# Altium project gpa-zynq-module.PrjPcb
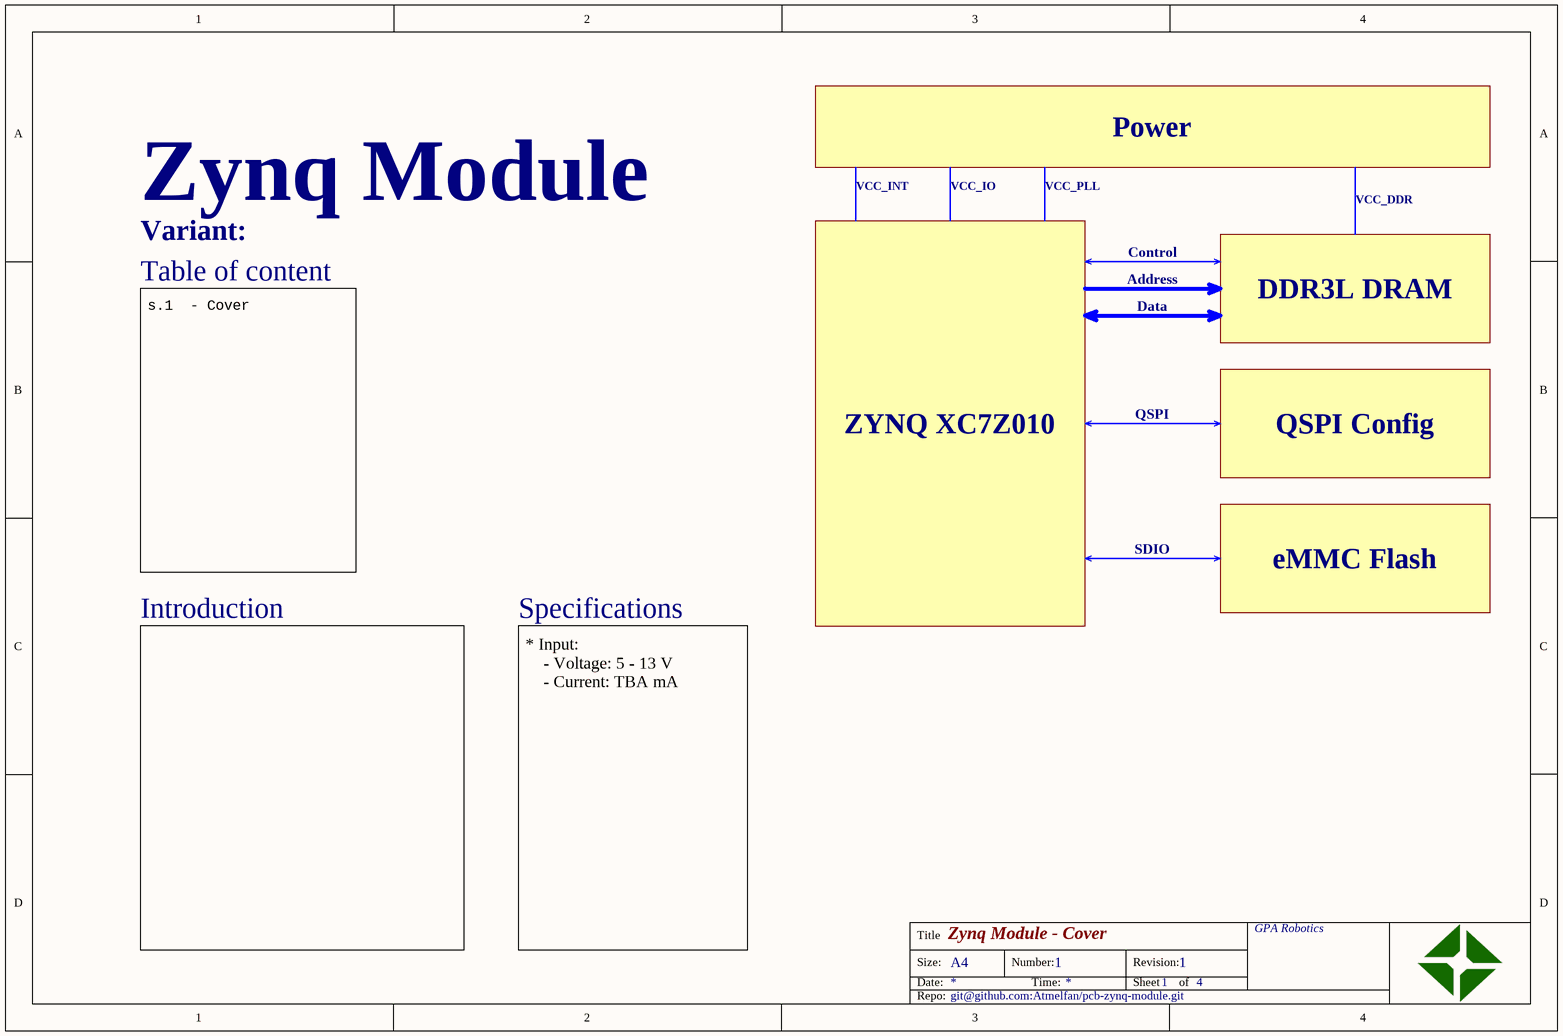
[diagram p0: cover.SchDoc]
project_author: Gustav Palmqvist; project_name: Zynq Module; project_repo: git@github.com:Atmelfan/pcb-zynq-module.git; project_revision: 1
11 sheets, 97 parts. Net scope: hierarchical (ports join the sheet entries above them; power ports are global).
Board file: model_a.PcbDoc
Sheets:
  cover.SchDoc
  connectors.SchDoc
    POWER = power.SchDoc
    ZYNQ = fpga.SchDoc
      FPGA_POWER = fpga_power.SchDoc
      FPGA_DDR3L = fpga_ddr3l.SchDoc
      FPGA_MISC = fpga_misc.SchDoc
      FPGA_MIO = fpga_mio.SchDoc
      FPGA_BANK34 = fpga_bank34.SchDoc
      FPGA_BANK35 = fpga_bank35.SchDoc
    ETHERNET = ethernet.SchDoc

## Sheet cover.SchDoc: Cover
size A4; Organization: GPA Robotics; DocumentNumber: 1; SheetNumber: 1; SheetTotal: 4

### Notes on the sheet
- Power
- VCC_INT
- VCC_IO
- VCC_PLL
- VCC_DDR
- Table of content
- Control
- Address
- Data
- DDR3L DRAM
- ZYNQ XC7Z010
- QSPI
- QSPI Config
- s.1  - Cover
- SDIO
- eMMC Flash
- Introduction
- Specifications
- * Input:
  - Voltage: 5 - 13 V
  - Current: TBA mA
- Variant:
- Title
- Size:
- Date:
- A4
- Number:
- Time:
- Revision:
- Sheet
- of
- Repo:

## Sheet connectors.SchDoc
size A4
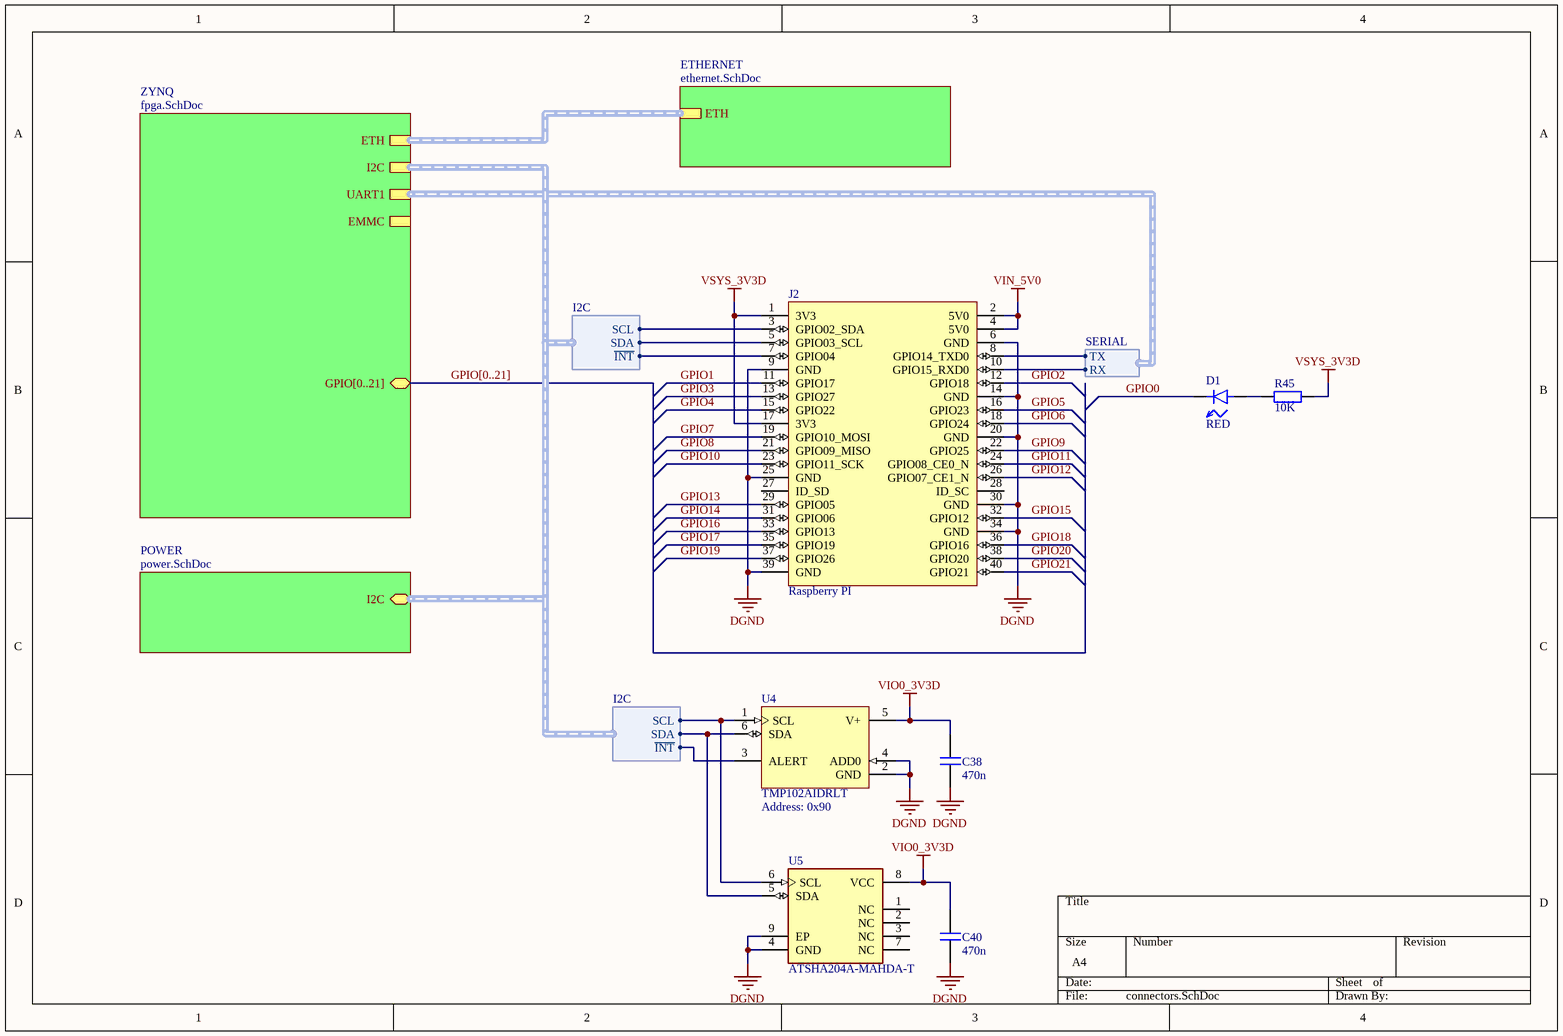
[diagram p1: connectors.SchDoc]

### Parts
C38  value 470n  [CAPC1608X08N]  (hidden comment: cap)
C40  value 470n  [CAPC1608X08N]  (hidden comment: cap)
D1  value RED  [CAPCP1005X06N]  (hidden comment: led)
J2  Raspberry PI  [raspi_male_con]
R45  value 10K  [RESC1005X04N]  (hidden comment: res)
U4  TMP102AIDRLT  Address: 0x90  [DRL0006A_L]
U5  ATSHA204A-MAHDA-T  [FP-C04-21355-Q4B-MFG]

### Sub-sheets
ETHERNET = ethernet.SchDoc: ETH (harness ETHERNET)
POWER = power.SchDoc: I2C (bidir, harness I2C)
ZYNQ = fpga.SchDoc: ETH (harness ETHERNET), I2C (harness I2C), EMMC (harness SDCARD), UART1 (harness SERIAL), GPIO[0..21] (bidir)

### Harnesses
I2C: SDA, SCL, ~{INT}
SERIAL: TX, RX

### Nets
DGND: C38.2 C40.2 J2.6(GND) J2.9(GND) J2.14(GND) J2.20(GND) J2.25(GND) J2.30(GND) J2.34(GND) J2.39(GND) U4.2(GND) U4.4(ADD0) U5.4(GND) U5.9(EP)
VIN_5V0: J2.2(5V0) J2.4(5V0)
VIO0_3V3D: C38.1 C40.1 U4.5(V+) U5.8(VCC)  [project net CFGBVS]
VSYS_3V3D: J2.1(3V3) J2.17(3V3) R45.2
~{I2C_INT}: J2.7(GPIO04) U4.3(ALERT) ; sheet POWER/I2C.~{INT}
GPIO0: D1.C
GPIO1: J2.11(GPIO17)
GPIO2: J2.12(GPIO18)
GPIO3: J2.13(GPIO27)
GPIO4: J2.15(GPIO22)
GPIO5: J2.16(GPIO23)
GPIO6: J2.18(GPIO24)
GPIO7: J2.19(GPIO10_MOSI)
GPIO8: J2.21(GPIO09_MISO)
GPIO9: J2.22(GPIO25)
GPIO10: J2.23(GPIO11_SCK)
GPIO11: J2.24(GPIO08_CE0_N)
GPIO12: J2.26(GPIO07_CE1_N)
GPIO13: J2.29(GPIO05)
GPIO14: J2.31(GPIO06)
GPIO15: J2.32(GPIO12)
GPIO16: J2.33(GPIO13)
GPIO17: J2.35(GPIO19)
GPIO18: J2.36(GPIO16)
GPIO19: J2.37(GPIO26)
GPIO20: J2.38(GPIO20)
GPIO21: J2.40(GPIO21)
I2C_SCL: J2.3(GPIO02_SDA) U4.1(SCL) U5.6(SCL) ; sheet POWER/I2C.SCL
I2C_SDA: J2.5(GPIO03_SCL) U4.6(SDA) U5.5(SDA) ; sheet POWER/I2C.SDA
UART1_RX: J2.10(GPIO15_RXD0) ; sheet ZYNQ/UART1.RX
UART1_TX: J2.8(GPIO14_TXD0) ; sheet ZYNQ/UART1.TX
NetD1_A: D1.A R45.1

Not connected (* = marked no-connect by the designer): J2 27(ID_SD) 28(ID_SC); U5 1(NC) 2(NC) 3(NC) 7(NC)

### Buses and harness runs
bus GPIO[0..21] = sheet ZYNQ/GPIO[0..21]
harness sheet ETHERNET/ETH = sheet ZYNQ/ETH
harness sheet POWER/I2C = sheet ZYNQ/I2C

### Library data of the parts
C38 C40 = cap: Capacitor; voltage: *; type: *; #digikey: *; #mouser: *
D1 = led: pin to pad: A>1 C>2
J2 = raspberry_2x20_con: Raspberry PI 2x20 connector
R45 = res: Resistor; power: *; voltage: *; #digikey: *; #mouser: *
U4 = CMP-1685-00013-1: Low Power Digital Temperature Sensor with SMBus and Two-Wire Serial Interface, 1.4 to 3.6 V, -40 to 125 degC, 6-Pin SOT (DRL), Green (RoHS & no Sb/Br), Tape and Reel; ComponentLink3URL: http://www.ti.com/lit/ml/mpds159c/mpds159c.pdf; PackageVersion: 4205622-3/D, 08/2207; ComponentLink2Description: Datasheet; PackageReference: DRL0006A; ComponentLink2URL: http://www.ti.com/lit/ds/symlink/tmp102.pdf; ComponentLink3Description: Package Specification; ComponentLink1Description: Manufacturer URL; DatasheetVersion: SBOS397F, 12/2015; PackageDescription: 6-Pin Plastic Small Outline, Body 1.6 x 1.2 mm, Pitch 0.5 mm; ComponentLink1URL: http://www.ti.com/
U5 = CMP-06260-000005-1: IC AUTHENTICATION CHIP 8UDFN; Manufacturer: Microchip Technology; Standoff Height: 0mm; Description: Peripheral Controller Atmel Crypto EEPROM 8-Pin UDFN; Ambient Temperature Range High: +85°C; Ambient Temperature Range Low: -40°C; Octopart: https://octopart.com/atsha204a-mahda-t-microchip-77761815; Device Class L1: Integrated Circuits (ICs); Digikey Description: IC AUTHENTICATION CHIP 8UDFN; RoHS: TRUE; Device Class L3: unset; Temperature: -40°C to +85°C; Temperature Range High: +85°C; Height: 0.6mm; Device Class L2: unset; Category: IC; Automotive: No; Package: C04-21355-Q4B; Lead Free: Yes; ComponentLink2Description: Datasheet; Temperature Range Low: -40°C; ComponentLink2URL: http://ww1.microchip.com/downloads/en/DeviceDoc/ATSHA204A-Data-Sheet-40002025A.pdf; Manufacturer Part Number: ATSHA204A-MAHDA-T

## Sheet power.SchDoc: Power supplies
size A4; Organization: GPA Robotics; DocumentNumber: 2; Revision: REV 0; SheetNumber: 2; SheetTotal: 4
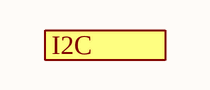
[diagram p2: power.SchDoc]

### Ports
I2C (harness I2C)

### Notes on the sheet
- Title
- Size:
- Date:
- A4
- Number:
- Time:
- Revision:
- Sheet
- of
- Repo:

## Sheet fpga.SchDoc
size A4
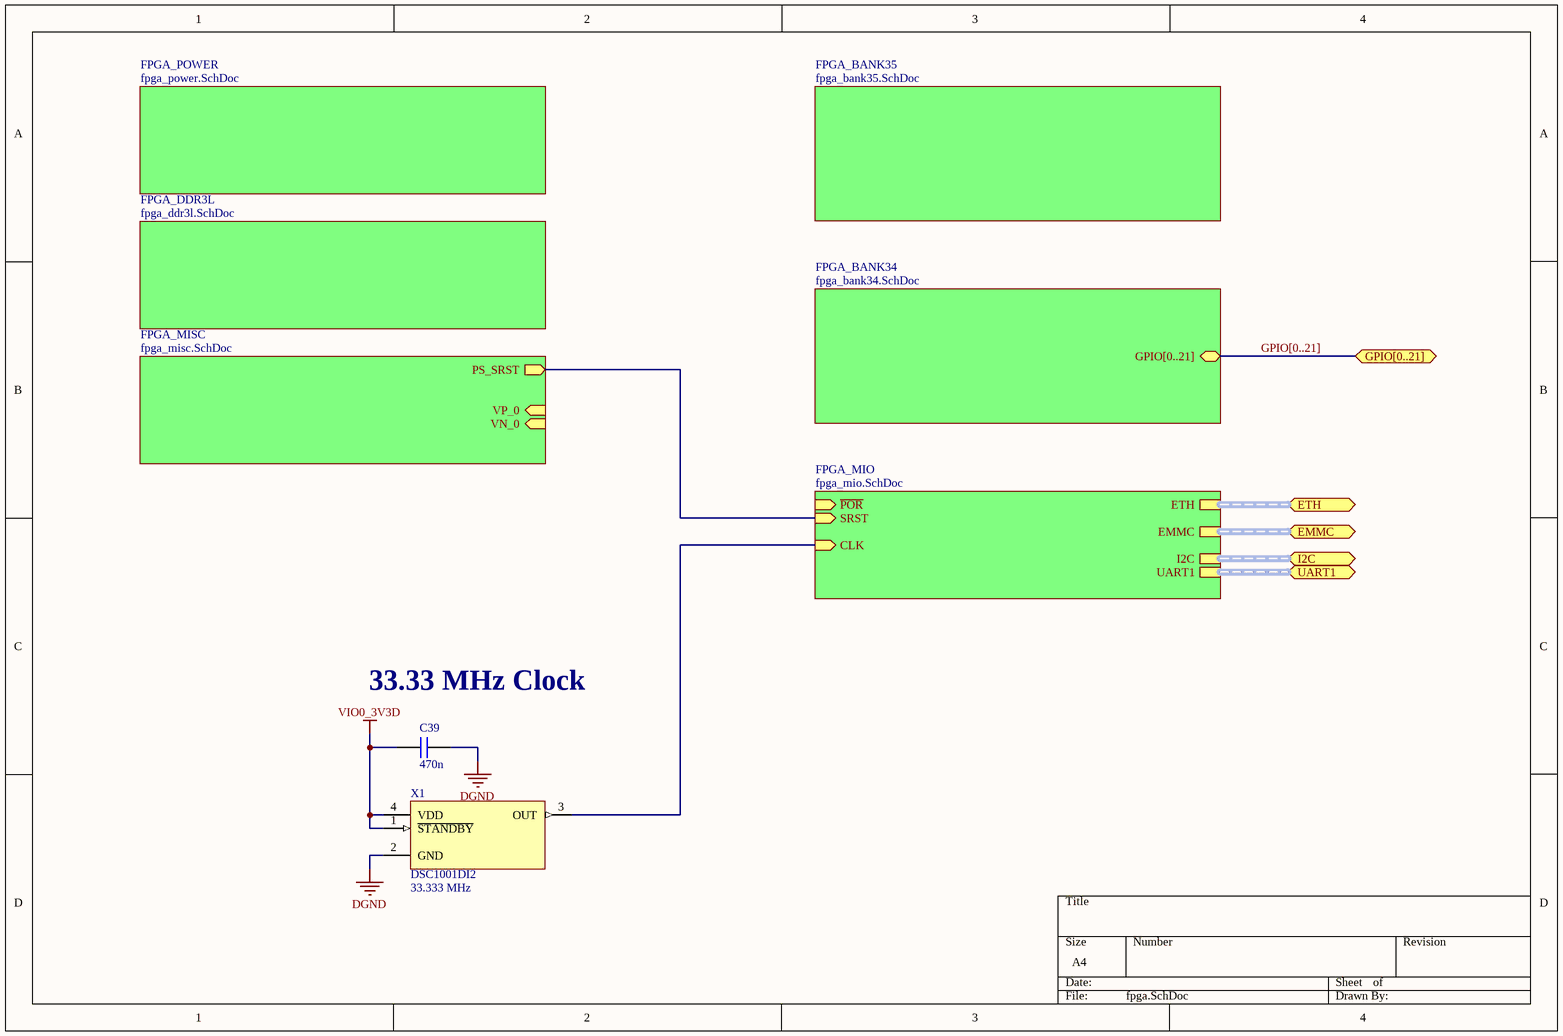
[diagram p3: fpga.SchDoc]

### Parts
C39  value 470n  [CAPC1608X08N]  (hidden comment: cap)
X1  DSC1001DI2  Frequency: 33.333 MHz  [DFN165P200X90-4N_DSC1001DIx]

### Sub-sheets
FPGA_BANK34 = fpga_bank34.SchDoc: GPIO[0..21] (bidir)
FPGA_BANK35 = fpga_bank35.SchDoc: no entries
FPGA_DDR3L = fpga_ddr3l.SchDoc: no entries
FPGA_MIO = fpga_mio.SchDoc: UART1 (harness SERIAL), ~{POR} (in), CLK (in), EMMC (harness SDCARD), I2C (harness I2C), SRST (in), ETH (harness ETHERNET)
FPGA_MISC = fpga_misc.SchDoc: VP_0 (in), VN_0 (in), PS_SRST (out)
FPGA_POWER = fpga_power.SchDoc: no entries

### Ports
EMMC (bidir), ETH (bidir), GPIO[0..21] (bidir), I2C (bidir), UART1 (bidir)

### Nets
DGND: C39.1 X1.2(GND)
VIO0_3V3D: C39.2 X1.1(~{STANDBY}) X1.4(VDD)  [project net CFGBVS]
NetJ1_10: sheet FPGA_MISC/PS_SRST, sheet FPGA_MIO/SRST
NetU2_C7: X1.3(OUT) ; sheet FPGA_MIO/CLK

### Buses and harness runs
bus GPIO[0..21] = port GPIO[0..21] = sheet FPGA_BANK34/GPIO[0..21]
harness port EMMC = sheet FPGA_MIO/EMMC
harness port ETH = sheet FPGA_MIO/ETH
harness port I2C = sheet FPGA_MIO/I2C
harness port UART1 = sheet FPGA_MIO/UART1

### Notes on the sheet
- (near C39) 33.33 MHz Clock

### Library data of the parts
C39 = cap: Capacitor; voltage: *; type: *; #digikey: *; #mouser: *
X1 = dsc1001dix: 1.8V-3.3V Low-Power Precision CMOS Oscillators

## Sheet fpga_power.SchDoc: FPGA Power
size A4; Organization: GPA Robotics; Revision: REV 0
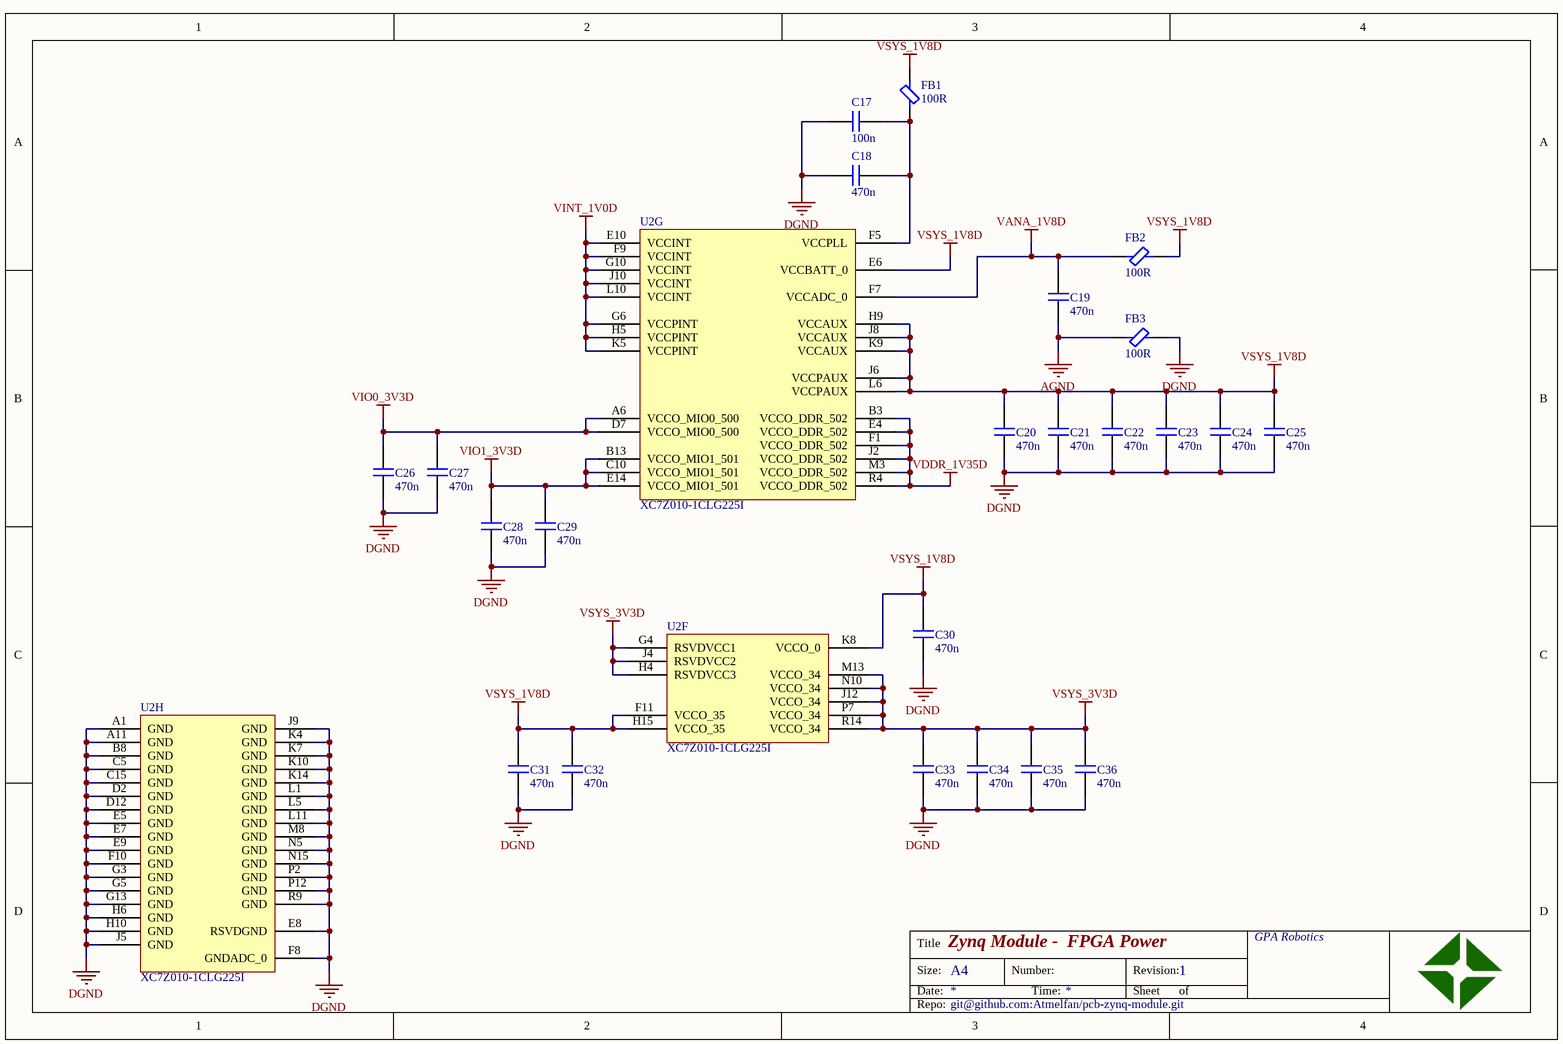
[diagram p4: fpga_power.SchDoc]

### Parts
C17  value 100n  [CAPC2012X11N]  (hidden comment: cap)
C18  value 470n  [CAPC1608X08N]  (hidden comment: cap)
C19  value 470n  [CAPC1608X08N]  (hidden comment: cap)
C20  value 470n  [CAPC1608X08N]  (hidden comment: cap)
C21  value 470n  [CAPC1608X08N]  (hidden comment: cap)
C22  value 470n  [CAPC1608X08N]  (hidden comment: cap)
C23  value 470n  [CAPC1608X08N]  (hidden comment: cap)
C24  value 470n  [CAPC1608X08N]  (hidden comment: cap)
C25  value 470n  [CAPC1608X08N]  (hidden comment: cap)
C26  value 470n  [CAPC1608X08N]  (hidden comment: cap)
C27  value 470n  [CAPC1608X08N]  (hidden comment: cap)
C28  value 470n  [CAPC1608X08N]  (hidden comment: cap)
C29  value 470n  [CAPC1608X08N]  (hidden comment: cap)
C30  value 470n  [CAPC1608X08N]  (hidden comment: cap)
C31  value 470n  [CAPC1608X08N]  (hidden comment: cap)
C32  value 470n  [CAPC1608X08N]  (hidden comment: cap)
C33  value 470n  [CAPC1608X08N]  (hidden comment: cap)
C34  value 470n  [CAPC1608X08N]  (hidden comment: cap)
C35  value 470n  [CAPC1608X08N]  (hidden comment: cap)
C36  value 470n  [CAPC1608X08N]  (hidden comment: cap)
FB1  value 100R  [INDC1005X06N]  (hidden comment: ferrite)
FB2  value 100R  [INDC1005X06N]  (hidden comment: ferrite)
FB3  value 100R  [INDC1005X06N]  (hidden comment: ferrite)
U2  XC7Z010-1CLG225I  [CLG225]  (parts F,G,H of 8)

### Nets
AGND: C19.1 FB3.2
DGND: C17.1 C18.1 C20.1 C21.1 C22.1 C23.1 C24.1 C25.1 C26.1 C27.1 C28.1 C29.1 C30.1 C31.1 C32.1 C33.1 C34.1 C35.1 C36.1 FB3.1 U2.A1(GND) U2.A11(GND) U2.B8(GND) U2.C5(GND) U2.C15(GND) U2.D2(GND) U2.D12(GND) U2.E5(GND) U2.E7(GND) U2.E8(RSVDGND) U2.E9(GND) U2.F8(GNDADC_0) U2.F10(GND) U2.G3(GND) U2.G5(GND) U2.G13(GND) U2.H6(GND) U2.H10(GND) U2.J5(GND) U2.J9(GND) U2.K4(GND) U2.K7(GND) U2.K10(GND) U2.K14(GND) U2.L1(GND) U2.L5(GND) U2.L11(GND) U2.M8(GND) U2.N5(GND) U2.N15(GND) U2.P2(GND) U2.P12(GND) U2.R9(GND)
VANA_1V8D: C19.2 FB2.2 U2.F7(VCCADC_0)
VDDR_1V35D: U2.B3(VCCO_DDR_502) U2.E4(VCCO_DDR_502) U2.F1(VCCO_DDR_502) U2.J2(VCCO_DDR_502) U2.M3(VCCO_DDR_502) U2.R4(VCCO_DDR_502)
VINT_1V0D: U2.E10(VCCINT) U2.F9(VCCINT) U2.G6(VCCPINT) U2.G10(VCCINT) U2.H5(VCCPINT) U2.J10(VCCINT) U2.K5(VCCPINT) U2.L10(VCCINT)
VIO0_3V3D: C26.2 C27.2 U2.A6(VCCO_MIO0_500) U2.D7(VCCO_MIO0_500)  [project net CFGBVS]
VIO1_3V3D: C28.2 C29.2 U2.B13(VCCO_MIO1_501) U2.C10(VCCO_MIO1_501) U2.E14(VCCO_MIO1_501)
VSYS_1V8D: C20.2 C21.2 C22.2 C23.2 C24.2 C25.2 C30.2 C31.2 C32.2 FB1.2 FB2.1 U2.E6(VCCBATT_0) U2.F11(VCCO_35) U2.H9(VCCAUX) U2.H15(VCCO_35) U2.J6(VCCPAUX) U2.J8(VCCAUX) U2.K8(VCCO_0) U2.K9(VCCAUX) U2.L6(VCCPAUX)
VSYS_3V3D: C33.2 C34.2 C35.2 C36.2 U2.G4(RSVDVCC1) U2.H4(RSVDVCC3) U2.J4(RSVDVCC2) U2.J12(VCCO_34) U2.M13(VCCO_34) U2.N10(VCCO_34) U2.P7(VCCO_34) U2.R14(VCCO_34)
NetC17_2: C17.2 C18.2 FB1.1 U2.F5(VCCPLL)

### Notes on the sheet
- Title
- Size:
- Date:
- A4
- Number:
- Time:
- Revision:
- Sheet
- of
- Repo:

### Library data of the parts
C17-C36 = cap: Capacitor; voltage: *; type: *; #digikey: *; #mouser: *
FB1-FB3 = ferrite: Inductor; #digikey: *; #mouser: *
U2 = CMP-0382-00001-1: 667 MHz Zynq™-7000 AP SoC, 88 PS I/O, 54 FPGA I/O, 225-Ball BGA, Speed Grade 1, Industrial Grade, Pb-Free; LUTs: 17600; Extensible Block RAM (# 36Kb Blocks): 240 KB (60); Speed Grade: -1; Flip Flops: 35200; DatasheetVersion: v1.2; ComponentLink4Description: Package File; ComponentLink1URL: http://www.xilinx.com/support/documentation/data_sheets/ds190-Zynq-7000-Overview.pdf; ComponentLink5URL: http://www.xilinx.com/support/documentation/user_guides/ug865-Zynq-7000-Pkg-Pinout.pdf; ComponentLink5Description: Packaging and Pinout; PartNumber: XC7Z010-1CLG225I; PackageVersion: Rev 1.2, 02/2013; ComponentLink3Description: DC and AC Switching Characteristics; ComponentLink2URL: http://www.xilinx.com/support/documentation/user_guides/ug865-Zynq-7000-Pkg-Pinout.pdf; ComponentLink3URL: http://www.xilinx.com/support/documentation/data_sheets/ds187-XC7Z010-XC7Z020-Data-Sheet.pdf; ComponentLink6URL: http://www.xilinx.com/support/documentation/user_guides/ug483_7Series_PCB.pdf; ComponentLink2Description: Package Specification; PackageReference: CLG225; ComponentLink1Description: Datasheet; ComponentLink4URL: http://www.xilinx.com/support/packagefiles/z7packages/xc7z010clg225pkg.txt; Generic Part Number: XC7Z010; ComponentLink6Description: PCB and Layout Guide; Mounting Technology: Surface Mount; PackageDescription: Wire-Bond Chip-Scale BGA, Body 13 x 13 mm, 0.8 mm Pitch; Code_JEDEC: MO-275-HHAC-1; RoHS: Pb-Free

## Sheet fpga_ddr3l.SchDoc: FPGA DDR3L Memory
size A4; Organization: GPA Robotics; DocumentNumber: 4; Revision: REV 0; SheetNumber: 4; SheetTotal: 4
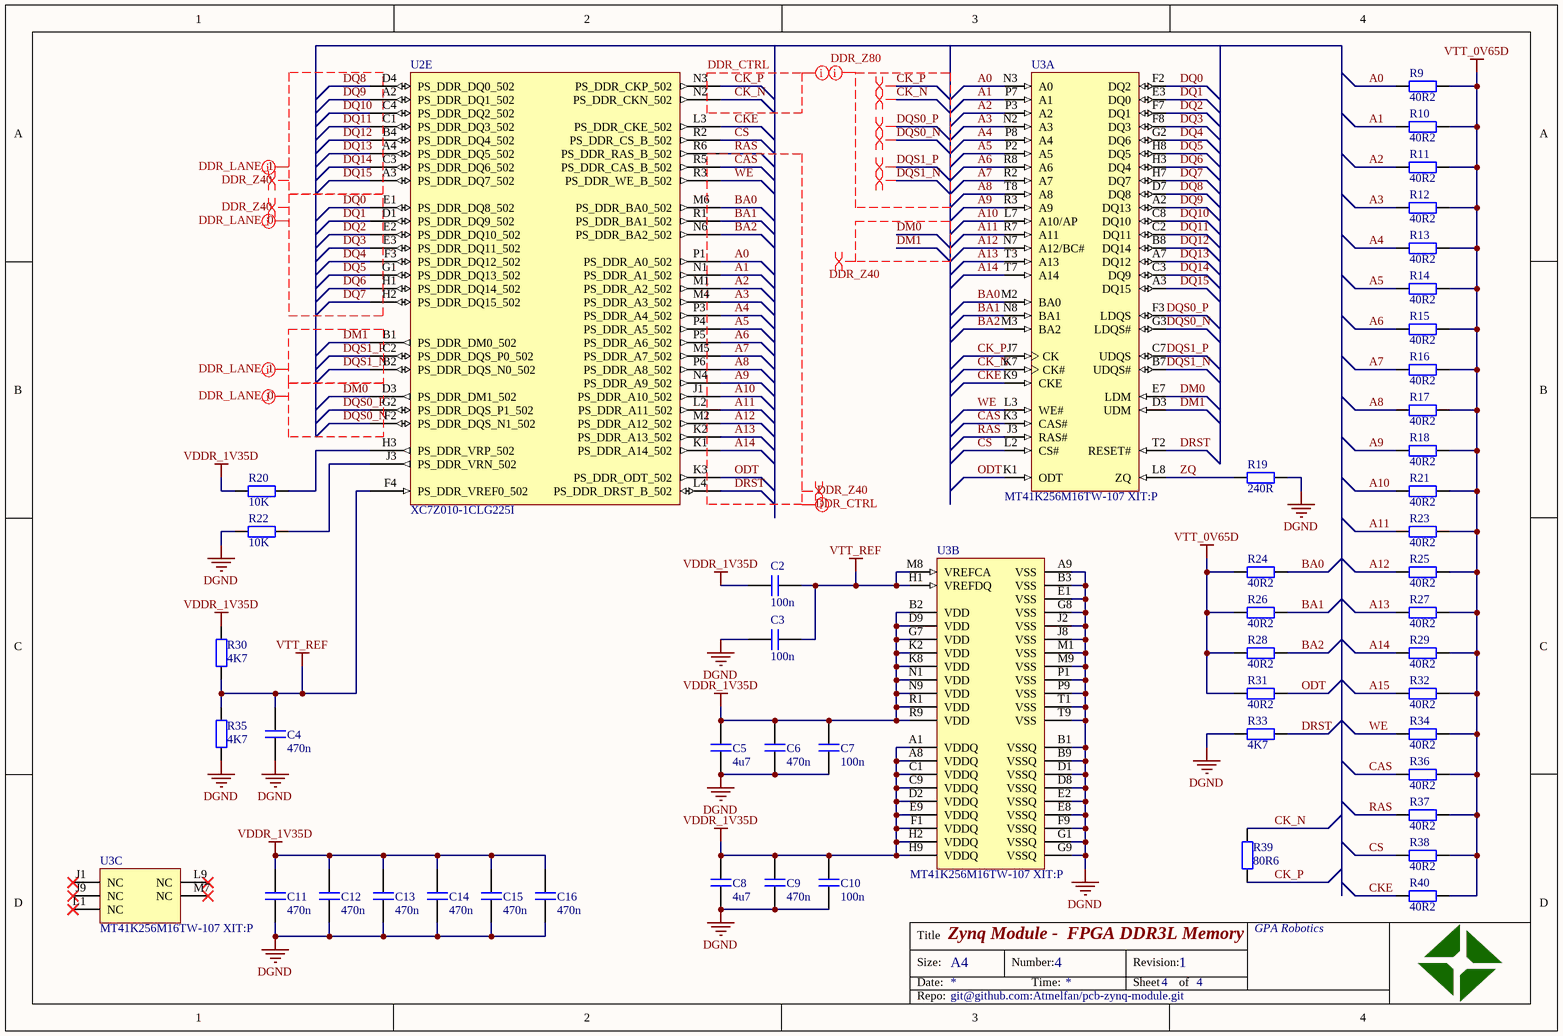
[diagram p5: fpga_ddr3l.SchDoc]

### Parts
C2  value 100n  [CAPC1005X06N]  (hidden comment: cap)
C3  value 100n  [CAPC1005X06N]  (hidden comment: cap)
C4  value 470n  [CAPC1005X06N]  (hidden comment: cap)
C5  value 4u7  [CAPC1608X08N]  (hidden comment: cap)
C6  value 470n  [CAPC1005X06N]  (hidden comment: cap)
C7  value 100n  [CAPC1005X06N]  (hidden comment: cap)
C8  value 4u7  [CAPC1608X08N]  (hidden comment: cap)
C9  value 470n  [CAPC1005X06N]  (hidden comment: cap)
C10  value 100n  [CAPC1005X06N]  (hidden comment: cap)
C11  value 470n  [CAPC1005X06N]  (hidden comment: cap)
C12  value 470n  [CAPC1005X06N]  (hidden comment: cap)
C13  value 470n  [CAPC1005X06N]  (hidden comment: cap)
C14  value 470n  [CAPC1005X06N]  (hidden comment: cap)
C15  value 470n  [CAPC1005X06N]  (hidden comment: cap)
C16  value 470n  [CAPC1005X06N]  (hidden comment: cap)
R9  value 40R2  [RESC1005X04N]  (hidden comment: res)
R10  value 40R2  [RESC1005X04N]  (hidden comment: res)
R11  value 40R2  [RESC1005X04N]  (hidden comment: res)
R12  value 40R2  [RESC1005X04N]  (hidden comment: res)
R13  value 40R2  [RESC1005X04N]  (hidden comment: res)
R14  value 40R2  [RESC1005X04N]  (hidden comment: res)
R15  value 40R2  [RESC1005X04N]  (hidden comment: res)
R16  value 40R2  [RESC1005X04N]  (hidden comment: res)
R17  value 40R2  [RESC1005X04N]  (hidden comment: res)
R18  value 40R2  [RESC1005X04N]  (hidden comment: res)
R19  value 240R  [RESC1005X04N]  (hidden comment: res)
R20  value 10K  [RESC1005X04N]  (hidden comment: res)
R21  value 40R2  [RESC1005X04N]  (hidden comment: res)
R22  value 10K  [RESC1005X04N]  (hidden comment: res)
R23  value 40R2  [RESC1005X04N]  (hidden comment: res)
R24  value 40R2  [RESC1005X04N]  (hidden comment: res)
R25  value 40R2  [RESC1005X04N]  (hidden comment: res)
R26  value 40R2  [RESC1005X04N]  (hidden comment: res)
R27  value 40R2  [RESC1005X04N]  (hidden comment: res)
R28  value 40R2  [RESC1005X04N]  (hidden comment: res)
R29  value 40R2  [RESC1005X04N]  (hidden comment: res)
R30  value 4K7  [RESC1005X04N]  (hidden comment: res)
R31  value 40R2  [RESC1005X04N]  (hidden comment: res)
R32  value 40R2  [RESC1005X04N]  (hidden comment: res)
R33  value 4K7  [RESC1005X04N]  (hidden comment: res)
R34  value 40R2  [RESC1005X04N]  (hidden comment: res)
R35  value 4K7  [RESC1005X04N]  (hidden comment: res)
R36  value 40R2  [RESC1005X04N]  (hidden comment: res)
R37  value 40R2  [RESC1005X04N]  (hidden comment: res)
R38  value 40R2  [RESC1005X04N]  (hidden comment: res)
R39  value 80R6  [RESC1005X04N]  (hidden comment: res)
R40  value 40R2  [RESC1005X04N]  (hidden comment: res)
U2  XC7Z010-1CLG225I  [CLG225]  (part E of 8)
U3  MT41K256M16TW-107 XIT:P  [MICT-TW-96]  (parts A,B,C of 3)

### Nets
DGND: C3.1 C4.1 C5.1 C6.1 C7.1 C8.1 C9.1 C10.1 C11.1 C12.1 C13.1 C14.1 C15.1 C16.1 R19.2 R22.1 R33.2 R35.1 U3.A9(VSS) U3.B1(VSSQ) U3.B3(VSS) U3.B9(VSSQ) U3.D1(VSSQ) U3.D8(VSSQ) U3.E1(VSS) U3.E2(VSSQ) U3.E8(VSSQ) U3.F9(VSSQ) U3.G1(VSSQ) U3.G8(VSS) U3.G9(VSSQ) U3.J2(VSS) U3.J8(VSS) U3.M1(VSS) U3.M9(VSS) U3.P1(VSS) U3.P9(VSS) U3.T1(VSS) U3.T9(VSS)
VDDR_1V35D: C2.1 C5.2 C6.2 C7.2 C8.2 C9.2 C10.2 C11.2 C12.2 C13.2 C14.2 C15.2 C16.2 R20.1 R30.2 U3.A1(VDDQ) U3.A8(VDDQ) U3.B2(VDD) U3.C1(VDDQ) U3.C9(VDDQ) U3.D2(VDDQ) U3.D9(VDD) U3.E9(VDDQ) U3.F1(VDDQ) U3.G7(VDD) U3.H2(VDDQ) U3.H9(VDDQ) U3.K2(VDD) U3.K8(VDD) U3.N1(VDD) U3.N9(VDD) U3.R1(VDD) U3.R9(VDD)
VTT_0V65D: R9.2 R10.2 R11.2 R12.2 R13.2 R14.2 R15.2 R16.2 R17.2 R18.2 R21.2 R23.2 R24.2 R25.2 R26.2 R27.2 R28.2 R29.2 R31.2 R32.2 R34.2 R36.2 R37.2 R38.2 R40.2
VTT_REF: C2.2 C3.2 C4.2 R30.1 R35.2 U2.F4(PS_DDR_VREF0_502) U3.H1(VREFDQ) U3.M8(VREFCA)
A0: R9.1 U2.P1(PS_DDR_A0_502) U3.N3(A0)
A1: R10.1 U2.N1(PS_DDR_A1_502) U3.P7(A1)
A2: R11.1 U2.M1(PS_DDR_A2_502) U3.P3(A2)
A3: R12.1 U2.M4(PS_DDR_A3_502) U3.N2(A3)
A4: R13.1 U2.P3(PS_DDR_A4_502) U3.P8(A4)
A5: R14.1 U2.P4(PS_DDR_A5_502) U3.P2(A5)
A6: R15.1 U2.P5(PS_DDR_A6_502) U3.R8(A6)
A7: R16.1 U2.M5(PS_DDR_A7_502) U3.R2(A7)
A8: R17.1 U2.P6(PS_DDR_A8_502) U3.T8(A8)
A9: R18.1 U2.N4(PS_DDR_A9_502) U3.R3(A9)
A10: R21.1 U2.J1(PS_DDR_A10_502) U3.L7(A10/AP)
A11: R23.1 U2.L2(PS_DDR_A11_502) U3.R7(A11)
A12: R25.1 U2.M2(PS_DDR_A12_502) U3.N7(A12/BC#)
A13: R27.1 U2.K2(PS_DDR_A13_502) U3.T3(A13)
A14: R29.1 U2.K1(PS_DDR_A14_502) U3.T7(A14)
A15: R32.1
BA0: R24.1 U2.M6(PS_DDR_BA0_502) U3.M2(BA0)
BA1: R26.1 U2.R1(PS_DDR_BA1_502) U3.N8(BA1)
BA2: R28.1 U2.N6(PS_DDR_BA2_502) U3.M3(BA2)
CAS: R36.1 U2.R5(PS_DDR_CAS_B_502) U3.K3(CAS#)
CK_N: R39.1 U2.N2(PS_DDR_CKN_502) U3.K7(CK#)
CK_P: R39.2 U2.N3(PS_DDR_CKP_502) U3.J7(CK)
CKE: R40.1 U2.L3(PS_DDR_CKE_502) U3.K9(CKE)
CS: R38.1 U2.R2(PS_DDR_CS_B_502) U3.L2(CS#)
DM0: U2.D3(PS_DDR_DM1_502) U3.E7(LDM)
DM1: U2.B1(PS_DDR_DM0_502) U3.D3(UDM)
DQ0: U2.E1(PS_DDR_DQ8_502) U3.F2(DQ2)
DQ1: U2.D1(PS_DDR_DQ9_502) U3.E3(DQ0)
DQ2: U2.E2(PS_DDR_DQ10_502) U3.F7(DQ1)
DQ3: U2.E3(PS_DDR_DQ11_502) U3.F8(DQ3)
DQ4: U2.F3(PS_DDR_DQ12_502) U3.G2(DQ6)
DQ5: U2.G1(PS_DDR_DQ13_502) U3.H8(DQ5)
DQ6: U2.H1(PS_DDR_DQ14_502) U3.H3(DQ4)
DQ7: U2.H2(PS_DDR_DQ15_502) U3.H7(DQ7)
DQ8: U2.D4(PS_DDR_DQ0_502) U3.D7(DQ8)
DQ9: U2.A2(PS_DDR_DQ1_502) U3.A2(DQ13)
DQ10: U2.C4(PS_DDR_DQ2_502) U3.C8(DQ10)
DQ11: U2.C1(PS_DDR_DQ3_502) U3.C2(DQ11)
DQ12: U2.B4(PS_DDR_DQ4_502) U3.B8(DQ14)
DQ13: U2.A4(PS_DDR_DQ5_502) U3.A7(DQ12)
DQ14: U2.C3(PS_DDR_DQ6_502) U3.C3(DQ9)
DQ15: U2.A3(PS_DDR_DQ7_502) U3.A3(DQ15)
DQS0_N: U2.F2(PS_DDR_DQS_N1_502) U3.G3(LDQS#)
DQS0_P: U2.G2(PS_DDR_DQS_P1_502) U3.F3(LDQS)
DQS1_N: U2.B2(PS_DDR_DQS_N0_502) U3.B7(UDQS#)
DQS1_P: U2.C2(PS_DDR_DQS_P0_502) U3.C7(UDQS)
DRST: R33.1 U2.L4(PS_DDR_DRST_B_502) U3.T2(RESET#)
ODT: R31.1 U2.K3(PS_DDR_ODT_502) U3.K1(ODT)
RAS: R37.1 U2.R6(PS_DDR_RAS_B_502) U3.J3(RAS#)
WE: R34.1 U2.R3(PS_DDR_WE_B_502) U3.L3(WE#)
ZQ: R19.1 U3.L8(ZQ)
NetR20_2: R20.2 U2.H3(PS_DDR_VRP_502)
NetR22_2: R22.2 U2.J3(PS_DDR_VRN_502)

Not connected (* = marked no-connect by the designer): U3 J1(NC)* J9(NC)* L1(NC)* L9(NC)* M7(NC)*

### Layout directives
net class DDR_CTRL: A0, A1, A2, A3, A4, A5, A6, A7, A8, A9, A10, A11, A12, A13, A14, BA0, BA1, BA2, CAS, CK_N, CK_P, DRST, ODT, RAS, WE
net class DDR_LANE_1; rule Matched Net Lengths [Delay Tolerance = 15ps]: DM1, DQ8, DQ9, DQ10, DQ11, DQ12, DQ13, DQ14, DQ15, DQS1_N, DQS1_P
net class DDR_LANE_0; rule Matched Net Lengths [Delay Tolerance = 15ps]: DM0, DQ0, DQ1, DQ2, DQ3, DQ4, DQ5, DQ6, DQ7, DQS0_N, DQS0_P
net class DDR_Z40: A0, A1, A2, A3, A4, A5, A6, A7, A8, A9, A10, A11, A12, A13, A14, BA0, BA1, BA2, CAS, DM0, DM1, DQ0, DQ1, DQ2, DQ3, DQ4, DQ5, DQ6, DQ7, DQ8, DQ9, DQ10, DQ11, DQ12, DQ13, DQ14, DQ15, DRST, ODT, RAS, WE
differential pair: CK_N, CK_P, DQS0_N, DQS0_P, DQS1_N, DQS1_P
net class DDR_Z80; rule Matched Net Lengths [Tolerance = 5mil]: CK_N, CK_P, DQS0_N, DQS0_P, DQS1_N, DQS1_P

### Notes on the sheet
- Title
- Size:
- Date:
- A4
- Number:
- Time:
- Revision:
- Sheet
- of
- Repo:

### Library data of the parts
C2-C16 = cap: Capacitor; voltage: *; type: *; #digikey: *; #mouser: *
R9-R40 = res: Resistor; power: *; voltage: *; #digikey: *; #mouser: *
U2 = CMP-0382-00001-1: as U2 on sheet fpga_power; DatasheetVersion: v1.2; ComponentLink4Description: Package File; ComponentLink1URL: http://www.xilinx.com/support/documentation/data_sheets/ds190-Zynq-7000-Overview.pdf; ComponentLink5URL: http://www.xilinx.com/support/documentation/user_guides/ug865-Zynq-7000-Pkg-Pinout.pdf; ComponentLink5Description: Packaging and Pinout; PartNumber: XC7Z010-1CLG225I; PackageVersion: Rev 1.2, 02/2013; ComponentLink3Description: DC and AC Switching Characteristics; ComponentLink2URL: http://www.xilinx.com/support/documentation/user_guides/ug865-Zynq-7000-Pkg-Pinout.pdf; ComponentLink3URL: http://www.xilinx.com/support/documentation/data_sheets/ds187-XC7Z010-XC7Z020-Data-Sheet.pdf; ComponentLink6URL: http://www.xilinx.com/support/documentation/user_guides/ug483_7Series_PCB.pdf; ComponentLink2Description: Package Specification; PackageReference: CLG225; ComponentLink1Description: Datasheet; ComponentLink4URL: http://www.xilinx.com/support/packagefiles/z7packages/xc7z010clg225pkg.txt; Generic Part Number: XC7Z010; ComponentLink6Description: PCB and Layout Guide; Mounting Technology: Surface Mount; PackageDescription: Wire-Bond Chip-Scale BGA, Body 13 x 13 mm, 0.8 mm Pitch; Code_JEDEC: MO-275-HHAC-1; RoHS: Pb-Free
U3 = CMP-2000-07474-1: DDR3L SDRAM, 4 GB, 933 MHz, 1.283 to 1.45 V, -40 to 95 degC, 96-Pin FBGA, RoHs, Tray; Manufacturer: Micron; Density: 4Gb; Interface: Parallel; Access Time: 1.07ns; Data Bus Width: 16b; Case\/Package: TFBGA; Address Bus Width: 15b; Frequency: 933MHz; Memory Type: RAM; Contact Plating: Silver; RoHSCompliant: true; Datasheet URL: https://www.micron.com/~/media/documents/products/data-sheet/dram/ddr3/4gb_1_35v_ddr3l_xit_addendum.pdf; Manufacturer URL: http://www.micron.com/; Mount: SurfaceMount; Max Operating Temperature: 95degC; Datasheet Version: Rev. A, 02/2016; Min Operating Temperature: -40degC; Packaging: Tray; Mounting Technology: SurfaceMount; Max Frequency: 933MHz; Package Reference: TW-96; Package Description: 96-Ball Fine Pitch Ball Grid Array, Body 14 x 8 mm, Pitch 0.8 mm

## Sheet fpga_misc.SchDoc
size A4
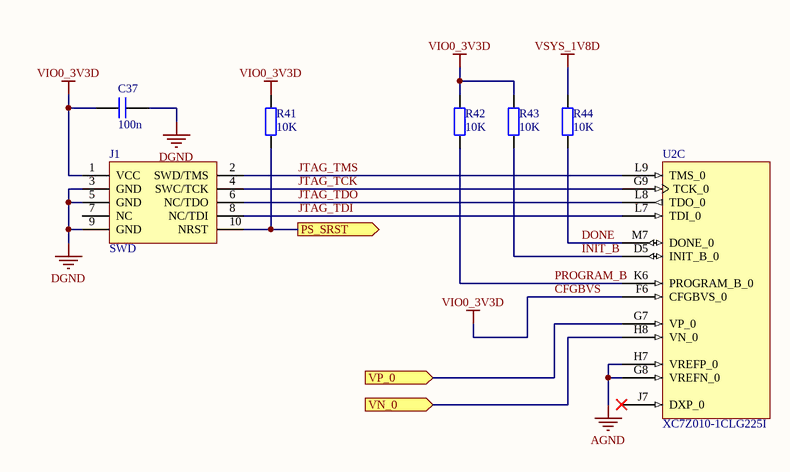
[diagram p6: fpga_misc.SchDoc]

### Parts
C37  value 100n  [CAPC1005X06N]  (hidden comment: cap)
J1  SWD  [hdr_2x5_50mil]
R41  value 10K  [RESC1005X04N]  (hidden comment: res)
R42  value 10K  [RESC1005X04N]  (hidden comment: res)
R43  value 10K  [RESC1005X04N]  (hidden comment: res)
R44  value 10K  [RESC1005X04N]  (hidden comment: res)
U2  XC7Z010-1CLG225I  [CLG225]  (part C of 8)

### Ports
PS_SRST (out), VN_0 (in), VP_0 (in)

### Nets
AGND: U2.G8(VREFN_0) U2.H7(VREFP_0)
CFGBVS: C37.1 J1.1(VCC) R41.2 R42.2 R43.2 U2.F6(CFGBVS_0)  [also labelled VIO0_3V3D]
DGND: C37.2 J1.3(GND) J1.5(GND) J1.9(GND)
VSYS_1V8D: R44.2
DONE: R44.1 U2.M7(DONE_0)
INIT_B: R43.1 U2.D5(INIT_B_0)
JTAG_TCK: J1.4(SWC/TCK) U2.G9(TCK_0)
JTAG_TDI: J1.8(NC/TDI) U2.L7(TDI_0)
JTAG_TDO: J1.6(NC/TDO) U2.L8(TDO_0)
JTAG_TMS: J1.2(SWD/TMS) U2.L9(TMS_0)
PROGRAM_B: R42.1 U2.K6(PROGRAM_B_0)
NetJ1_10: J1.10(NRST) R41.1 ; port PS_SRST
NetU2_G7: U2.G7(VP_0) ; port VP_0
NetU2_H8: U2.H8(VN_0) ; port VN_0

Not connected (* = marked no-connect by the designer): J1 7(NC); U2 J7(DXP_0)*

### Library data of the parts
C37 = cap: Capacitor; voltage: *; type: *; #digikey: *; #mouser: *
J1 = hdr_swd: SWD Header
R41-R44 = res: Resistor; power: *; voltage: *; #digikey: *; #mouser: *
U2 = CMP-0382-00001-1: as U2 on sheet fpga_power; DatasheetVersion: v1.2; ComponentLink4Description: Package File; ComponentLink1URL: http://www.xilinx.com/support/documentation/data_sheets/ds190-Zynq-7000-Overview.pdf; ComponentLink5URL: http://www.xilinx.com/support/documentation/user_guides/ug865-Zynq-7000-Pkg-Pinout.pdf; ComponentLink5Description: Packaging and Pinout; PartNumber: XC7Z010-1CLG225I; PackageVersion: Rev 1.2, 02/2013; ComponentLink3Description: DC and AC Switching Characteristics; ComponentLink2URL: http://www.xilinx.com/support/documentation/user_guides/ug865-Zynq-7000-Pkg-Pinout.pdf; ComponentLink3URL: http://www.xilinx.com/support/documentation/data_sheets/ds187-XC7Z010-XC7Z020-Data-Sheet.pdf; ComponentLink6URL: http://www.xilinx.com/support/documentation/user_guides/ug483_7Series_PCB.pdf; ComponentLink2Description: Package Specification; PackageReference: CLG225; ComponentLink1Description: Datasheet; ComponentLink4URL: http://www.xilinx.com/support/packagefiles/z7packages/xc7z010clg225pkg.txt; Generic Part Number: XC7Z010; ComponentLink6Description: PCB and Layout Guide; Mounting Technology: Surface Mount; PackageDescription: Wire-Bond Chip-Scale BGA, Body 13 x 13 mm, 0.8 mm Pitch; Code_JEDEC: MO-275-HHAC-1; RoHS: Pb-Free

## Sheet fpga_mio.SchDoc: FPGA MIO
size A4; Organization: GPA Robotics; DocumentNumber: 3; Revision: REV 0; SheetNumber: 3; SheetTotal: 4
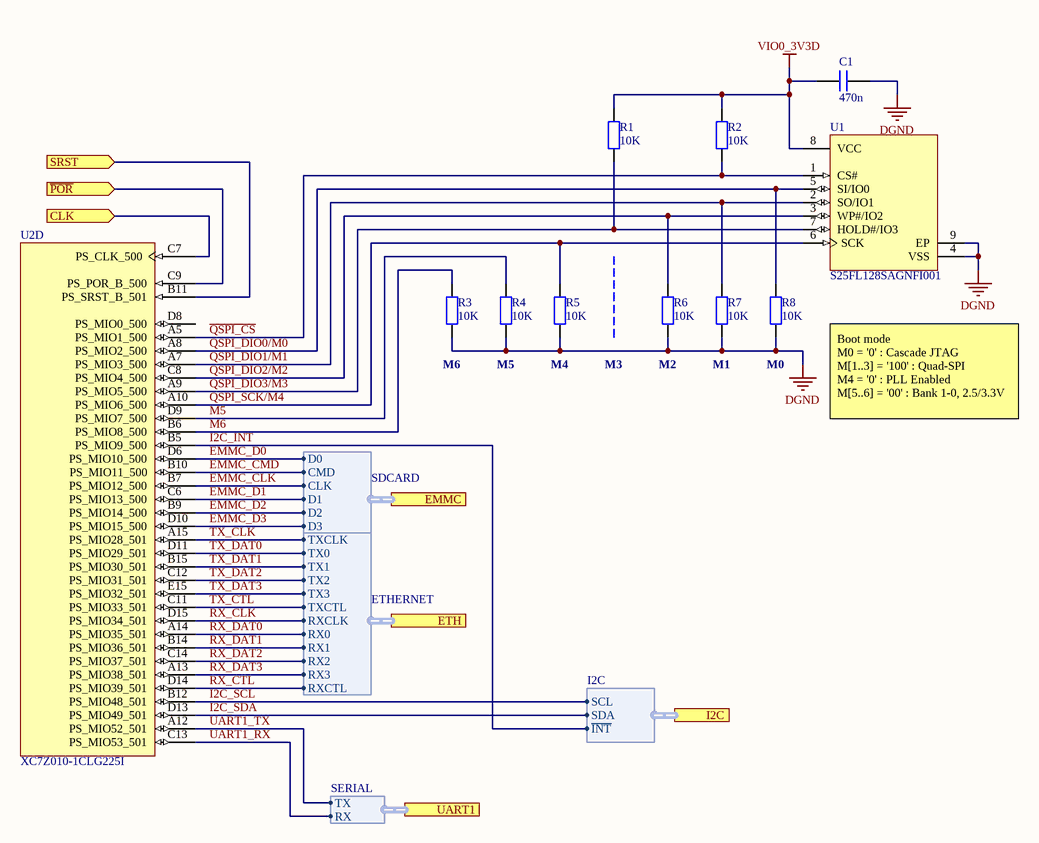
[diagram p7: fpga_mio.SchDoc]

### Parts
C1  value 470n  [CAPC1608X08N]  (hidden comment: cap)
R1  value 10K  [RESC1005X04N]  (hidden comment: res)
R2  value 10K  [RESC1005X04N]  (hidden comment: res)
R3  value 10K  [RESC1005X04N]  (hidden comment: res)
R4  value 10K  [RESC1005X04N]  (hidden comment: res)
R5  value 10K  [RESC1005X04N]  (hidden comment: res)
R6  value 10K  [RESC1005X04N]  (hidden comment: res)
R7  value 10K  [RESC1005X04N]  (hidden comment: res)
R8  value 10K  [RESC1005X04N]  (hidden comment: res)
U1  S25FL128SAGNFI001  [SPSN-WSON-8_N]
U2  XC7Z010-1CLG225I  [CLG225]  (part D of 8)

### Ports
CLK (in), EMMC (harness SDCARD), ETH (harness ETHERNET), I2C (harness I2C), SRST (in), UART1 (harness SERIAL), ~{POR} (in)

### Harnesses
I2C: SDA, SCL, ~{INT}
SDCARD: D0, D1, D2, D3, CMD, CLK
ETHERNET: TX0, TX1, TX2, TX3, RX0, RX1, RX2, RX3, TXCLK, TXCTL, RXCLK, RXCTL
SERIAL: TX, RX

### Nets
DGND: C1.1 R3.1 R4.1 R5.1 R6.1 R7.1 R8.1 U1.4(VSS) U1.9(EP)
VIO0_3V3D: C1.2 R1.2 R2.2 U1.8(VCC)  [project net CFGBVS]
~{I2C_INT}: U2.B5(PS_MIO9_500) ; port I2C.~{INT}
~{QSPI_CS}: R2.1 U1.1(CS#) U2.A5(PS_MIO1_500)
EMMC_CLK: U2.B7(PS_MIO12_500) ; port EMMC.CLK
EMMC_CMD: U2.B10(PS_MIO11_500) ; port EMMC.CMD
EMMC_D0: U2.D6(PS_MIO10_500) ; port EMMC.D0
EMMC_D1: U2.C6(PS_MIO13_500) ; port EMMC.D1
EMMC_D2: U2.B9(PS_MIO14_500) ; port EMMC.D2
EMMC_D3: U2.D10(PS_MIO15_500) ; port EMMC.D3
I2C_SCL: U2.B12(PS_MIO48_501) ; port I2C.SCL
I2C_SDA: U2.D13(PS_MIO49_501) ; port I2C.SDA
M5: R4.2 U2.D9(PS_MIO7_500)
M6: R3.2 U2.B6(PS_MIO8_500)
QSPI_DIO0/M0: R8.2 U1.5(SI/IO0) U2.A8(PS_MIO2_500)
QSPI_DIO1/M1: R7.2 U1.2(SO/IO1) U2.A7(PS_MIO3_500)
QSPI_DIO2/M2: R6.2 U1.3(WP#/IO2) U2.C8(PS_MIO4_500)
QSPI_DIO3/M3: R1.1 U1.7(HOLD#/IO3) U2.A9(PS_MIO5_500)
QSPI_SCK/M4: R5.2 U1.6(SCK) U2.A10(PS_MIO6_500)
RX_CLK: U2.D15(PS_MIO34_501) ; port ETH.RXCLK
RX_CTL: U2.D14(PS_MIO39_501) ; port ETH.RXCTL
RX_DAT0: U2.A14(PS_MIO35_501) ; port ETH.RX0
RX_DAT1: U2.B14(PS_MIO36_501) ; port ETH.RX1
RX_DAT2: U2.C14(PS_MIO37_501) ; port ETH.RX2
RX_DAT3: U2.A13(PS_MIO38_501) ; port ETH.RX3
TX_CLK: U2.A15(PS_MIO28_501) ; port ETH.TXCLK
TX_CTL: U2.C11(PS_MIO33_501) ; port ETH.TXCTL
TX_DAT0: U2.D11(PS_MIO29_501) ; port ETH.TX0
TX_DAT1: U2.B15(PS_MIO30_501) ; port ETH.TX1
TX_DAT2: U2.C12(PS_MIO31_501) ; port ETH.TX2
TX_DAT3: U2.E15(PS_MIO32_501) ; port ETH.TX3
UART1_RX: U2.C13(PS_MIO53_501) ; port UART1.RX
UART1_TX: U2.A12(PS_MIO52_501) ; port UART1.TX
NetJ1_10: U2.B11(PS_SRST_B_501) ; port SRST
NetU2_C7: U2.C7(PS_CLK_500) ; port CLK
NetU2_C9: U2.C9(PS_POR_B_500) ; port ~{POR}

Not connected (* = marked no-connect by the designer): U2 D8(PS_MIO0_500)

### Notes on the sheet
- (near R3) M6
- (near R4) M5
- (near R5) M4
- M3
- (near R6) M2
- (near R7) M1
- (near R8) M0
- Boot mode
  M0 = '0' : Cascade JTAG
  M[1..3] = '100' : Quad-SPI
  M4 = '0' : PLL Enabled
  M[5..6] = '00' : Bank 1-0, 2.5/3.3V
- Title
- Size:
- Date:
- A4
- Number:
- Time:
- Revision:
- Sheet
- of
- Repo:

### Library data of the parts
C1 = cap: Capacitor; voltage: *; type: *; #digikey: *; #mouser: *
R1-R8 = res: Resistor; power: *; voltage: *; #digikey: *; #mouser: *
U1 = CMP-1329-00028-1: MirrorBit Flash Non-Volatile Memory CMOS 3.0 Volt Core with Versatile I/O, Serial Peripheral Interface with Multi-I/O, 128 Mbit, 133 MHz, -40 to 85 degC, 8-Pin WSON (WNG008), RoHS, Tube; Manufacturer: Spansion; OTP: 1024 B; Speed: 133 MHz; VCC: 2.7 to 3.6 V; ComponentLink3Description: Package Specification; ComponentLink2URL: http://www.spansion.com/Support/Datasheets/S25FL128S_256S_00.pdf; Packing: Tube; PartNumber: S25FL128SAGNFI001; PackageDescription: 8-Pin Plastic Small Outline, Body 6 x 8 mm, Pitch 1.27 mm; DatasheetVersion: Rev. 08; Temperature Range: -40 to 85 degC; ComponentLink3URL: http://www.spansion.com/Support/Datasheets/S25FL128S_256S_00.pdf; RoHS: TRUE; ComponentLink2Description: Datasheet; Density: 128 Mbit; ComponentLink1Description: Manufacturer URL; ComponentLink1URL: http://www.spansion.com/Pages/Default.aspx; Mounting Technology: Surface Mount
U2 = CMP-0382-00001-1: as U2 on sheet fpga_power; DatasheetVersion: v1.2; ComponentLink4Description: Package File; ComponentLink1URL: http://www.xilinx.com/support/documentation/data_sheets/ds190-Zynq-7000-Overview.pdf; ComponentLink5URL: http://www.xilinx.com/support/documentation/user_guides/ug865-Zynq-7000-Pkg-Pinout.pdf; ComponentLink5Description: Packaging and Pinout; PartNumber: XC7Z010-1CLG225I; PackageVersion: Rev 1.2, 02/2013; ComponentLink3Description: DC and AC Switching Characteristics; ComponentLink2URL: http://www.xilinx.com/support/documentation/user_guides/ug865-Zynq-7000-Pkg-Pinout.pdf; ComponentLink3URL: http://www.xilinx.com/support/documentation/data_sheets/ds187-XC7Z010-XC7Z020-Data-Sheet.pdf; ComponentLink6URL: http://www.xilinx.com/support/documentation/user_guides/ug483_7Series_PCB.pdf; ComponentLink2Description: Package Specification; PackageReference: CLG225; ComponentLink1Description: Datasheet; ComponentLink4URL: http://www.xilinx.com/support/packagefiles/z7packages/xc7z010clg225pkg.txt; Generic Part Number: XC7Z010; ComponentLink6Description: PCB and Layout Guide; Mounting Technology: Surface Mount; PackageDescription: Wire-Bond Chip-Scale BGA, Body 13 x 13 mm, 0.8 mm Pitch; Code_JEDEC: MO-275-HHAC-1; RoHS: Pb-Free

## Sheet fpga_bank34.SchDoc: FPGA Bank 34
size A4; Organization: GPA Robotics; Revision: REV 0
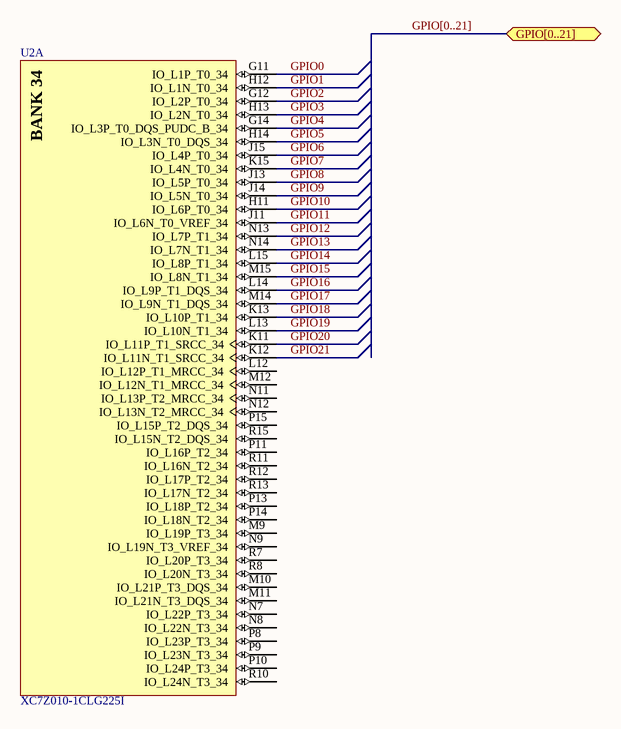
[diagram p8: fpga_bank34.SchDoc]

### Parts
U2  XC7Z010-1CLG225I  [CLG225]  (part A of 8)

### Ports
GPIO[0..21] (bidir)

### Nets
GPIO0: U2.G11(IO_L1P_T0_34)
GPIO1: U2.H12(IO_L1N_T0_34)
GPIO2: U2.G12(IO_L2P_T0_34)
GPIO3: U2.H13(IO_L2N_T0_34)
GPIO4: U2.G14(IO_L3P_T0_DQS_PUDC_B_34)
GPIO5: U2.H14(IO_L3N_T0_DQS_34)
GPIO6: U2.J15(IO_L4P_T0_34)
GPIO7: U2.K15(IO_L4N_T0_34)
GPIO8: U2.J13(IO_L5P_T0_34)
GPIO9: U2.J14(IO_L5N_T0_34)
GPIO10: U2.H11(IO_L6P_T0_34)
GPIO11: U2.J11(IO_L6N_T0_VREF_34)
GPIO12: U2.N13(IO_L7P_T1_34)
GPIO13: U2.N14(IO_L7N_T1_34)
GPIO14: U2.L15(IO_L8P_T1_34)
GPIO15: U2.M15(IO_L8N_T1_34)
GPIO16: U2.L14(IO_L9P_T1_DQS_34)
GPIO17: U2.M14(IO_L9N_T1_DQS_34)
GPIO18: U2.K13(IO_L10P_T1_34)
GPIO19: U2.L13(IO_L10N_T1_34)
GPIO20: U2.K11(IO_L11P_T1_SRCC_34)
GPIO21: U2.K12(IO_L11N_T1_SRCC_34)

Not connected (* = marked no-connect by the designer): U2 L12(IO_L12P_T1_MRCC_34) M9(IO_L19P_T3_34) M10(IO_L21P_T3_DQS_34) M11(IO_L21N_T3_DQS_34) M12(IO_L12N_T1_MRCC_34) N7(IO_L22P_T3_34) N8(IO_L22N_T3_34) N9(IO_L19N_T3_VREF_34) N11(IO_L13P_T2_MRCC_34) N12(IO_L13N_T2_MRCC_34) P8(IO_L23P_T3_34) P9(IO_L23N_T3_34) P10(IO_L24P_T3_34) P11(IO_L16P_T2_34) P13(IO_L18P_T2_34) P14(IO_L18N_T2_34) P15(IO_L15P_T2_DQS_34) R7(IO_L20P_T3_34) R8(IO_L20N_T3_34) R10(IO_L24N_T3_34) R11(IO_L16N_T2_34) R12(IO_L17P_T2_34) R13(IO_L17N_T2_34) R15(IO_L15N_T2_DQS_34)

### Buses and harness runs
bus GPIO[0..21] = port GPIO[0..21]

### Notes on the sheet
- Title
- Size:
- Date:
- A4
- Number:
- Time:
- Revision:
- Sheet
- of
- Repo:
- (in symbol CMP-0382-00001-1, part A) BANK 34

### Library data of the parts
U2 = CMP-0382-00001-1: as U2 on sheet fpga_power; DatasheetVersion: v1.2; ComponentLink4Description: Package File; ComponentLink1URL: http://www.xilinx.com/support/documentation/data_sheets/ds190-Zynq-7000-Overview.pdf; ComponentLink5URL: http://www.xilinx.com/support/documentation/user_guides/ug865-Zynq-7000-Pkg-Pinout.pdf; ComponentLink5Description: Packaging and Pinout; PartNumber: XC7Z010-1CLG225I; PackageVersion: Rev 1.2, 02/2013; ComponentLink3Description: DC and AC Switching Characteristics; ComponentLink2URL: http://www.xilinx.com/support/documentation/user_guides/ug865-Zynq-7000-Pkg-Pinout.pdf; ComponentLink3URL: http://www.xilinx.com/support/documentation/data_sheets/ds187-XC7Z010-XC7Z020-Data-Sheet.pdf; ComponentLink6URL: http://www.xilinx.com/support/documentation/user_guides/ug483_7Series_PCB.pdf; ComponentLink2Description: Package Specification; PackageReference: CLG225; ComponentLink1Description: Datasheet; ComponentLink4URL: http://www.xilinx.com/support/packagefiles/z7packages/xc7z010clg225pkg.txt; Generic Part Number: XC7Z010; ComponentLink6Description: PCB and Layout Guide; Mounting Technology: Surface Mount; PackageDescription: Wire-Bond Chip-Scale BGA, Body 13 x 13 mm, 0.8 mm Pitch; Code_JEDEC: MO-275-HHAC-1; RoHS: Pb-Free

## Sheet fpga_bank35.SchDoc: FPGA Bank 35
size A4; Organization: GPA Robotics; Revision: REV 0
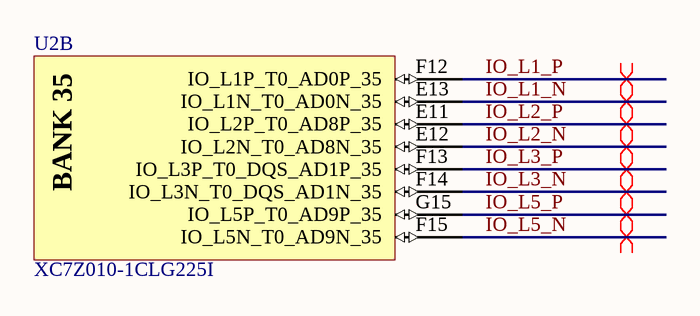
[diagram p9: fpga_bank35.SchDoc]

### Parts
U2  XC7Z010-1CLG225I  [CLG225]  (part B of 8)

### Nets
IO_L1_N: U2.E13(IO_L1N_T0_AD0N_35)
IO_L1_P: U2.F12(IO_L1P_T0_AD0P_35)
IO_L2_N: U2.E12(IO_L2N_T0_AD8N_35)
IO_L2_P: U2.E11(IO_L2P_T0_AD8P_35)
IO_L3_N: U2.F14(IO_L3N_T0_DQS_AD1N_35)
IO_L3_P: U2.F13(IO_L3P_T0_DQS_AD1P_35)
IO_L5_N: U2.F15(IO_L5N_T0_AD9N_35)
IO_L5_P: U2.G15(IO_L5P_T0_AD9P_35)

### Layout directives
differential pair: IO_L1_N, IO_L1_P, IO_L2_N, IO_L2_P, IO_L3_N, IO_L3_P, IO_L5_N, IO_L5_P

### Notes on the sheet
- Title
- Size:
- Date:
- A4
- Number:
- Time:
- Revision:
- Sheet
- of
- Repo:
- (in symbol CMP-0382-00001-1, part B) BANK 35

### Library data of the parts
U2 = CMP-0382-00001-1: as U2 on sheet fpga_power; DatasheetVersion: v1.2; ComponentLink4Description: Package File; ComponentLink1URL: http://www.xilinx.com/support/documentation/data_sheets/ds190-Zynq-7000-Overview.pdf; ComponentLink5URL: http://www.xilinx.com/support/documentation/user_guides/ug865-Zynq-7000-Pkg-Pinout.pdf; ComponentLink5Description: Packaging and Pinout; PartNumber: XC7Z010-1CLG225I; PackageVersion: Rev 1.2, 02/2013; ComponentLink3Description: DC and AC Switching Characteristics; ComponentLink2URL: http://www.xilinx.com/support/documentation/user_guides/ug865-Zynq-7000-Pkg-Pinout.pdf; ComponentLink3URL: http://www.xilinx.com/support/documentation/data_sheets/ds187-XC7Z010-XC7Z020-Data-Sheet.pdf; ComponentLink6URL: http://www.xilinx.com/support/documentation/user_guides/ug483_7Series_PCB.pdf; ComponentLink2Description: Package Specification; PackageReference: CLG225; ComponentLink1Description: Datasheet; ComponentLink4URL: http://www.xilinx.com/support/packagefiles/z7packages/xc7z010clg225pkg.txt; Generic Part Number: XC7Z010; ComponentLink6Description: PCB and Layout Guide; Mounting Technology: Surface Mount; PackageDescription: Wire-Bond Chip-Scale BGA, Body 13 x 13 mm, 0.8 mm Pitch; Code_JEDEC: MO-275-HHAC-1; RoHS: Pb-Free

## Sheet ethernet.SchDoc
size A4
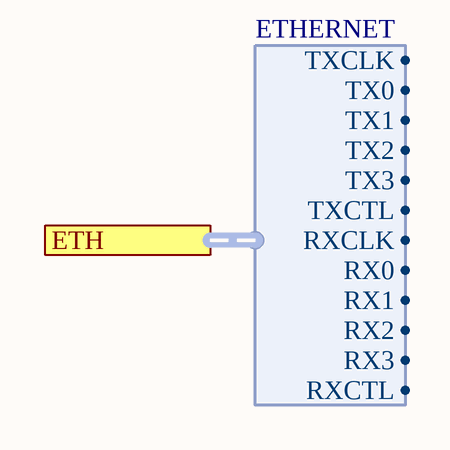
[diagram p10: ethernet.SchDoc]

### Ports
ETH (harness ETHERNET)

### Harnesses
ETHERNET: TX0, TX1, TX2, TX3, RX0, RX1, RX2, RX3, TXCLK, TXCTL, RXCLK, RXCTL

## Nets that join several sheets
AGND: fpga_power (C19.1 FB3.2), fpga_misc (U2.G8 U2.H7)
CFGBVS: connectors (C38.1 C40.1 U4.5 U5.8), fpga (C39.2 X1.1 X1.4), fpga_power (C26.2 C27.2 U2.A6 U2.D7), fpga_misc (6 pins), fpga_mio (C1.2 R1.2 R2.2 U1.8)
DGND: connectors (14 pins), fpga (C39.1 X1.2), fpga_power (53 pins), fpga_ddr3l (39 pins), fpga_misc (C37.2 J1.3 J1.5 J1.9), fpga_mio (9 pins)
VDDR_1V35D: fpga_power (6 pins), fpga_ddr3l (33 pins)
VSYS_1V8D: fpga_power (20 pins), fpga_misc (R44.2)
VSYS_3V3D: connectors (J2.1 J2.17 R45.2), fpga_power (12 pins)
~{I2C_INT}: connectors (J2.7 U4.3), fpga_mio (U2.B5)
GPIO0: connectors (D1.C), fpga_bank34 (U2.G11)
GPIO1: connectors (J2.11), fpga_bank34 (U2.H12)
GPIO2: connectors (J2.12), fpga_bank34 (U2.G12)
GPIO3: connectors (J2.13), fpga_bank34 (U2.H13)
GPIO4: connectors (J2.15), fpga_bank34 (U2.G14)
GPIO5: connectors (J2.16), fpga_bank34 (U2.H14)
GPIO6: connectors (J2.18), fpga_bank34 (U2.J15)
GPIO7: connectors (J2.19), fpga_bank34 (U2.K15)
GPIO8: connectors (J2.21), fpga_bank34 (U2.J13)
GPIO9: connectors (J2.22), fpga_bank34 (U2.J14)
GPIO10: connectors (J2.23), fpga_bank34 (U2.H11)
GPIO11: connectors (J2.24), fpga_bank34 (U2.J11)
GPIO12: connectors (J2.26), fpga_bank34 (U2.N13)
GPIO13: connectors (J2.29), fpga_bank34 (U2.N14)
GPIO14: connectors (J2.31), fpga_bank34 (U2.L15)
GPIO15: connectors (J2.32), fpga_bank34 (U2.M15)
GPIO16: connectors (J2.33), fpga_bank34 (U2.L14)
GPIO17: connectors (J2.35), fpga_bank34 (U2.M14)
GPIO18: connectors (J2.36), fpga_bank34 (U2.K13)
GPIO19: connectors (J2.37), fpga_bank34 (U2.L13)
GPIO20: connectors (J2.38), fpga_bank34 (U2.K11)
GPIO21: connectors (J2.40), fpga_bank34 (U2.K12)
I2C_SCL: connectors (J2.3 U4.1 U5.6), fpga_mio (U2.B12)
I2C_SDA: connectors (J2.5 U4.6 U5.5), fpga_mio (U2.D13)
NetJ1_10: fpga_misc (J1.10 R41.1), fpga_mio (U2.B11)
NetU2_C7: fpga (X1.3), fpga_mio (U2.C7)
UART1_RX: connectors (J2.10), fpga_mio (U2.C13)
UART1_TX: connectors (J2.8), fpga_mio (U2.A12)